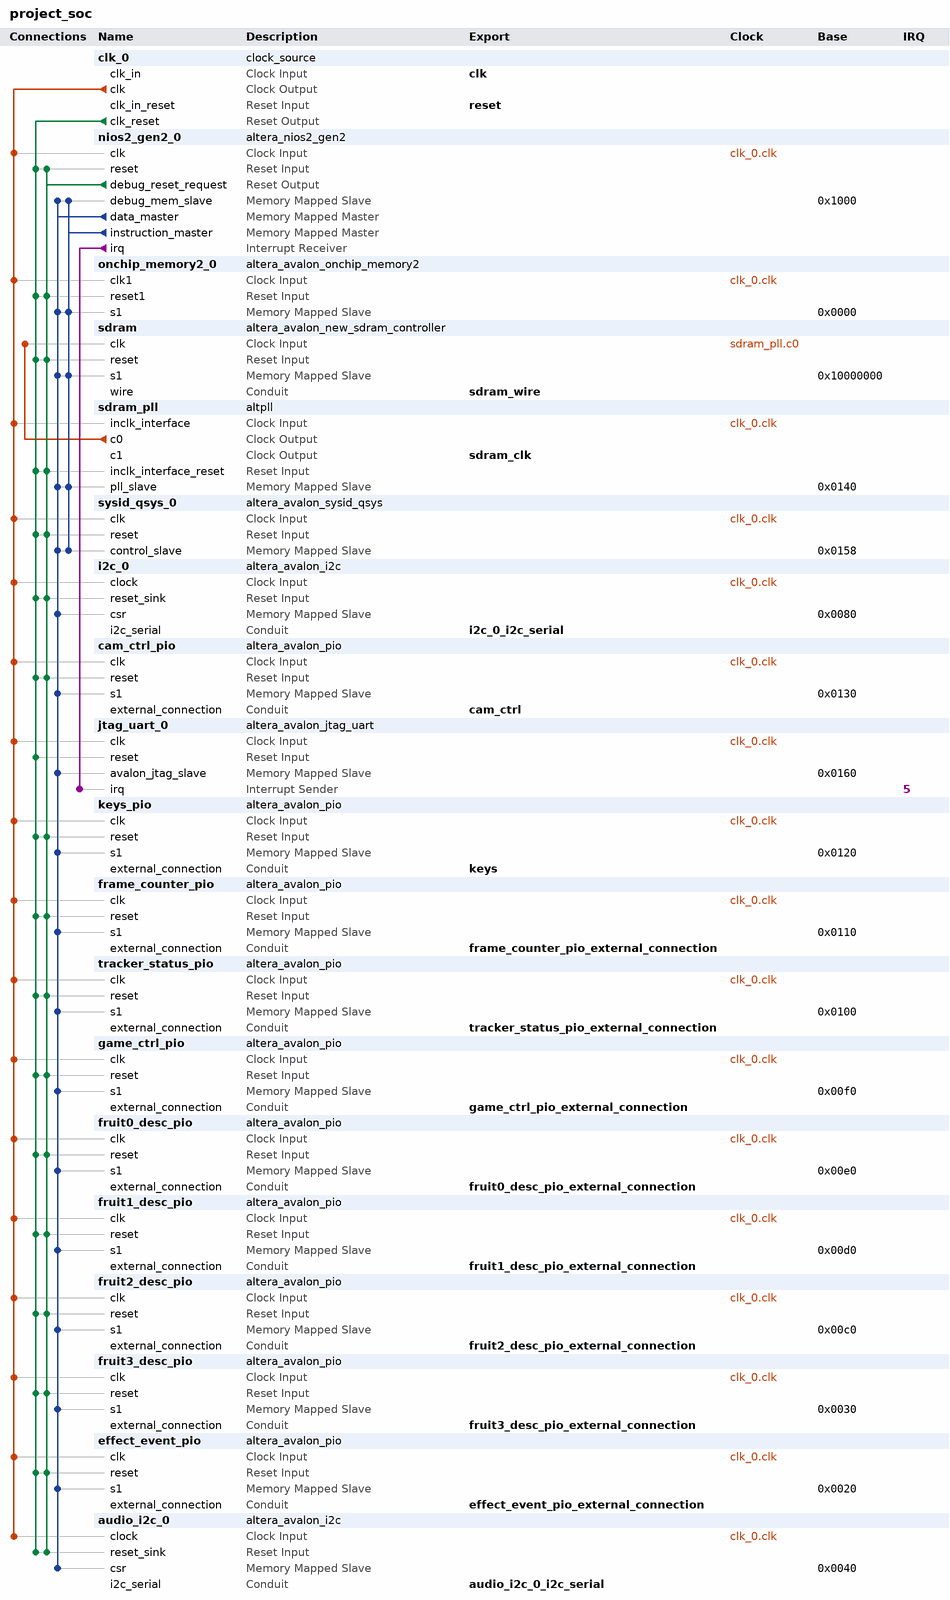
[diagram p0: system contents]
# Platform Designer (Qsys) system project_soc, Cyclone IV E EP4CE115F29C7
# Parameters at their usual value, and those the tool derives, are not listed.
package require -exact qsys 18.1
create_system project_soc
set_project_property DEVICE_FAMILY {Cyclone IV E}
set_project_property DEVICE EP4CE115F29C7

add_instance clk_0 clock_source 18.1
set_instance_parameter_value clk_0 clockFrequency 50000000

add_instance nios2_gen2_0 altera_nios2_gen2 18.1
set_instance_parameter_value nios2_gen2_0 dcache_size 2048
set_instance_parameter_value nios2_gen2_0 exceptionSlave sdram.s1
set_instance_parameter_value nios2_gen2_0 icache_size 4096
set_instance_parameter_value nios2_gen2_0 impl Tiny
set_instance_parameter_value nios2_gen2_0 resetSlave sdram.s1

add_instance onchip_memory2_0 altera_avalon_onchip_memory2 18.1
set_instance_parameter_value onchip_memory2_0 dataWidth 32
set_instance_parameter_value onchip_memory2_0 dualPort false
set_instance_parameter_value onchip_memory2_0 initMemContent true
set_instance_parameter_value onchip_memory2_0 initializationFileName onchip_mem.hex
set_instance_parameter_value onchip_memory2_0 memorySize 16

add_instance sdram altera_avalon_new_sdram_controller 18.1
set_instance_parameter_value sdram TAC 5.5
set_instance_parameter_value sdram TRCD 20.0
set_instance_parameter_value sdram TRP 20.0
set_instance_parameter_value sdram casLatency 3
set_instance_parameter_value sdram columnWidth 10
set_instance_parameter_value sdram dataWidth 32
set_instance_parameter_value sdram generateSimulationModel false
set_instance_parameter_value sdram model single_Micron_MT48LC4M32B2_7_chip
set_instance_parameter_value sdram numberOfBanks 4
set_instance_parameter_value sdram numberOfChipSelects 1
set_instance_parameter_value sdram powerUpDelay 200.0
set_instance_parameter_value sdram refreshPeriod 7.8125
set_instance_parameter_value sdram rowWidth 13

add_instance sdram_pll altpll 18.1
set_instance_parameter_value sdram_pll CLK0_DIVIDE_BY 1
set_instance_parameter_value sdram_pll CLK0_MULTIPLY_BY 1
set_instance_parameter_value sdram_pll CLK1_DIVIDE_BY 1
set_instance_parameter_value sdram_pll CLK1_DUTY_CYCLE 50
set_instance_parameter_value sdram_pll CLK1_MULTIPLY_BY 1
set_instance_parameter_value sdram_pll CLK1_PHASE_SHIFT -3000
set_instance_parameter_value sdram_pll INCLK0_INPUT_FREQUENCY 20000
set_instance_parameter_value sdram_pll PORT_ARESET PORT_UNUSED
set_instance_parameter_value sdram_pll PORT_LOCKED PORT_UNUSED
set_instance_parameter_value sdram_pll PORT_clk1 PORT_USED
set_instance_parameter_value sdram_pll PORT_clk2 PORT_UNUSED
set_instance_parameter_value sdram_pll PORT_clk3 PORT_UNUSED

add_instance sysid_qsys_0 altera_avalon_sysid_qsys 18.1
set_instance_parameter_value sysid_qsys_0 id 0

add_instance i2c_0 altera_avalon_i2c 18.1
set_instance_parameter_value i2c_0 FIFO_DEPTH 8

add_instance cam_ctrl_pio altera_avalon_pio 18.1
set_instance_parameter_value cam_ctrl_pio direction Output
set_instance_parameter_value cam_ctrl_pio resetValue 1
set_instance_parameter_value cam_ctrl_pio width 2

add_instance jtag_uart_0 altera_avalon_jtag_uart 18.1
set_instance_parameter_value jtag_uart_0 simInteractiveOptions NO_INTERACTIVE_WINDOWS

add_instance keys_pio altera_avalon_pio 18.1
set_instance_parameter_value keys_pio direction Input
set_instance_parameter_value keys_pio width 4

add_instance frame_counter_pio altera_avalon_pio 18.1
set_instance_parameter_value frame_counter_pio direction Input
set_instance_parameter_value frame_counter_pio width 32

add_instance tracker_status_pio altera_avalon_pio 18.1
set_instance_parameter_value tracker_status_pio direction Input
set_instance_parameter_value tracker_status_pio width 32

add_instance game_ctrl_pio altera_avalon_pio 18.1
set_instance_parameter_value game_ctrl_pio direction Output
set_instance_parameter_value game_ctrl_pio width 32

add_instance fruit0_desc_pio altera_avalon_pio 18.1
set_instance_parameter_value fruit0_desc_pio direction Output
set_instance_parameter_value fruit0_desc_pio width 32

add_instance fruit1_desc_pio altera_avalon_pio 18.1
set_instance_parameter_value fruit1_desc_pio direction Output
set_instance_parameter_value fruit1_desc_pio width 32

add_instance fruit2_desc_pio altera_avalon_pio 18.1
set_instance_parameter_value fruit2_desc_pio direction Output
set_instance_parameter_value fruit2_desc_pio width 32

add_instance fruit3_desc_pio altera_avalon_pio 18.1
set_instance_parameter_value fruit3_desc_pio direction Output
set_instance_parameter_value fruit3_desc_pio width 32

add_instance effect_event_pio altera_avalon_pio 18.1
set_instance_parameter_value effect_event_pio direction Output
set_instance_parameter_value effect_event_pio width 32

add_instance audio_i2c_0 altera_avalon_i2c 18.1
set_instance_parameter_value audio_i2c_0 FIFO_DEPTH 4

# connections
add_connection clk_0.clk audio_i2c_0.clock clock
add_connection clk_0.clk cam_ctrl_pio.clk clock
add_connection clk_0.clk effect_event_pio.clk clock
add_connection clk_0.clk frame_counter_pio.clk clock
add_connection clk_0.clk fruit0_desc_pio.clk clock
add_connection clk_0.clk fruit1_desc_pio.clk clock
add_connection clk_0.clk fruit2_desc_pio.clk clock
add_connection clk_0.clk fruit3_desc_pio.clk clock
add_connection clk_0.clk game_ctrl_pio.clk clock
add_connection clk_0.clk i2c_0.clock clock
add_connection clk_0.clk jtag_uart_0.clk clock
add_connection clk_0.clk keys_pio.clk clock
add_connection clk_0.clk nios2_gen2_0.clk clock
add_connection clk_0.clk onchip_memory2_0.clk1 clock
add_connection clk_0.clk sdram_pll.inclk_interface clock
add_connection clk_0.clk sysid_qsys_0.clk clock
add_connection clk_0.clk tracker_status_pio.clk clock
add_connection sdram_pll.c0 sdram.clk clock
add_connection clk_0.clk_reset audio_i2c_0.reset_sink reset
add_connection clk_0.clk_reset cam_ctrl_pio.reset reset
add_connection clk_0.clk_reset effect_event_pio.reset reset
add_connection clk_0.clk_reset frame_counter_pio.reset reset
add_connection clk_0.clk_reset fruit0_desc_pio.reset reset
add_connection clk_0.clk_reset fruit1_desc_pio.reset reset
add_connection clk_0.clk_reset fruit2_desc_pio.reset reset
add_connection clk_0.clk_reset fruit3_desc_pio.reset reset
add_connection clk_0.clk_reset game_ctrl_pio.reset reset
add_connection clk_0.clk_reset i2c_0.reset_sink reset
add_connection clk_0.clk_reset jtag_uart_0.reset reset
add_connection clk_0.clk_reset keys_pio.reset reset
add_connection clk_0.clk_reset nios2_gen2_0.reset reset
add_connection clk_0.clk_reset onchip_memory2_0.reset1 reset
add_connection clk_0.clk_reset sdram.reset reset
add_connection clk_0.clk_reset sdram_pll.inclk_interface_reset reset
add_connection clk_0.clk_reset sysid_qsys_0.reset reset
add_connection clk_0.clk_reset tracker_status_pio.reset reset
add_connection nios2_gen2_0.debug_reset_request audio_i2c_0.reset_sink reset
add_connection nios2_gen2_0.debug_reset_request cam_ctrl_pio.reset reset
add_connection nios2_gen2_0.debug_reset_request effect_event_pio.reset reset
add_connection nios2_gen2_0.debug_reset_request frame_counter_pio.reset reset
add_connection nios2_gen2_0.debug_reset_request fruit0_desc_pio.reset reset
add_connection nios2_gen2_0.debug_reset_request fruit1_desc_pio.reset reset
add_connection nios2_gen2_0.debug_reset_request fruit2_desc_pio.reset reset
add_connection nios2_gen2_0.debug_reset_request fruit3_desc_pio.reset reset
add_connection nios2_gen2_0.debug_reset_request game_ctrl_pio.reset reset
add_connection nios2_gen2_0.debug_reset_request i2c_0.reset_sink reset
add_connection nios2_gen2_0.debug_reset_request keys_pio.reset reset
add_connection nios2_gen2_0.debug_reset_request nios2_gen2_0.reset reset
add_connection nios2_gen2_0.debug_reset_request onchip_memory2_0.reset1 reset
add_connection nios2_gen2_0.debug_reset_request sdram.reset reset
add_connection nios2_gen2_0.debug_reset_request sdram_pll.inclk_interface_reset reset
add_connection nios2_gen2_0.debug_reset_request sysid_qsys_0.reset reset
add_connection nios2_gen2_0.debug_reset_request tracker_status_pio.reset reset
add_connection nios2_gen2_0.data_master audio_i2c_0.csr avalon
set_connection_parameter_value nios2_gen2_0.data_master/audio_i2c_0.csr baseAddress 0x0040
add_connection nios2_gen2_0.data_master cam_ctrl_pio.s1 avalon
set_connection_parameter_value nios2_gen2_0.data_master/cam_ctrl_pio.s1 baseAddress 0x0130
add_connection nios2_gen2_0.data_master effect_event_pio.s1 avalon
set_connection_parameter_value nios2_gen2_0.data_master/effect_event_pio.s1 baseAddress 0x0020
add_connection nios2_gen2_0.data_master frame_counter_pio.s1 avalon
set_connection_parameter_value nios2_gen2_0.data_master/frame_counter_pio.s1 baseAddress 0x0110
add_connection nios2_gen2_0.data_master fruit0_desc_pio.s1 avalon
set_connection_parameter_value nios2_gen2_0.data_master/fruit0_desc_pio.s1 baseAddress 0x00e0
add_connection nios2_gen2_0.data_master fruit1_desc_pio.s1 avalon
set_connection_parameter_value nios2_gen2_0.data_master/fruit1_desc_pio.s1 baseAddress 0x00d0
add_connection nios2_gen2_0.data_master fruit2_desc_pio.s1 avalon
set_connection_parameter_value nios2_gen2_0.data_master/fruit2_desc_pio.s1 baseAddress 0x00c0
add_connection nios2_gen2_0.data_master fruit3_desc_pio.s1 avalon
set_connection_parameter_value nios2_gen2_0.data_master/fruit3_desc_pio.s1 baseAddress 0x0030
add_connection nios2_gen2_0.data_master game_ctrl_pio.s1 avalon
set_connection_parameter_value nios2_gen2_0.data_master/game_ctrl_pio.s1 baseAddress 0x00f0
add_connection nios2_gen2_0.data_master i2c_0.csr avalon
set_connection_parameter_value nios2_gen2_0.data_master/i2c_0.csr baseAddress 0x0080
add_connection nios2_gen2_0.data_master jtag_uart_0.avalon_jtag_slave avalon
set_connection_parameter_value nios2_gen2_0.data_master/jtag_uart_0.avalon_jtag_slave baseAddress 0x0160
add_connection nios2_gen2_0.data_master keys_pio.s1 avalon
set_connection_parameter_value nios2_gen2_0.data_master/keys_pio.s1 baseAddress 0x0120
add_connection nios2_gen2_0.data_master nios2_gen2_0.debug_mem_slave avalon
set_connection_parameter_value nios2_gen2_0.data_master/nios2_gen2_0.debug_mem_slave baseAddress 0x1000
add_connection nios2_gen2_0.data_master onchip_memory2_0.s1 avalon
set_connection_parameter_value nios2_gen2_0.data_master/onchip_memory2_0.s1 baseAddress 0x0000
add_connection nios2_gen2_0.data_master sdram.s1 avalon
set_connection_parameter_value nios2_gen2_0.data_master/sdram.s1 baseAddress 0x10000000
add_connection nios2_gen2_0.data_master sdram_pll.pll_slave avalon
set_connection_parameter_value nios2_gen2_0.data_master/sdram_pll.pll_slave baseAddress 0x0140
add_connection nios2_gen2_0.data_master sysid_qsys_0.control_slave avalon
set_connection_parameter_value nios2_gen2_0.data_master/sysid_qsys_0.control_slave baseAddress 0x0158
add_connection nios2_gen2_0.data_master tracker_status_pio.s1 avalon
set_connection_parameter_value nios2_gen2_0.data_master/tracker_status_pio.s1 baseAddress 0x0100
add_connection nios2_gen2_0.instruction_master nios2_gen2_0.debug_mem_slave avalon
set_connection_parameter_value nios2_gen2_0.instruction_master/nios2_gen2_0.debug_mem_slave baseAddress 0x1000
add_connection nios2_gen2_0.instruction_master onchip_memory2_0.s1 avalon
set_connection_parameter_value nios2_gen2_0.instruction_master/onchip_memory2_0.s1 baseAddress 0x0000
add_connection nios2_gen2_0.instruction_master sdram.s1 avalon
set_connection_parameter_value nios2_gen2_0.instruction_master/sdram.s1 baseAddress 0x10000000
add_connection nios2_gen2_0.instruction_master sdram_pll.pll_slave avalon
set_connection_parameter_value nios2_gen2_0.instruction_master/sdram_pll.pll_slave baseAddress 0x0140
add_connection nios2_gen2_0.instruction_master sysid_qsys_0.control_slave avalon
set_connection_parameter_value nios2_gen2_0.instruction_master/sysid_qsys_0.control_slave baseAddress 0x0158
add_connection nios2_gen2_0.irq jtag_uart_0.irq interrupt
set_connection_parameter_value nios2_gen2_0.irq/jtag_uart_0.irq irqNumber 5

# exported interfaces
add_interface audio_i2c_0_i2c_serial conduit end
set_interface_property audio_i2c_0_i2c_serial EXPORT_OF audio_i2c_0.i2c_serial
add_interface cam_ctrl conduit end
set_interface_property cam_ctrl EXPORT_OF cam_ctrl_pio.external_connection
add_interface clk clock sink
set_interface_property clk EXPORT_OF clk_0.clk_in
add_interface effect_event_pio_external_connection conduit end
set_interface_property effect_event_pio_external_connection EXPORT_OF effect_event_pio.external_connection
add_interface frame_counter_pio_external_connection conduit end
set_interface_property frame_counter_pio_external_connection EXPORT_OF frame_counter_pio.external_connection
add_interface fruit0_desc_pio_external_connection conduit end
set_interface_property fruit0_desc_pio_external_connection EXPORT_OF fruit0_desc_pio.external_connection
add_interface fruit1_desc_pio_external_connection conduit end
set_interface_property fruit1_desc_pio_external_connection EXPORT_OF fruit1_desc_pio.external_connection
add_interface fruit2_desc_pio_external_connection conduit end
set_interface_property fruit2_desc_pio_external_connection EXPORT_OF fruit2_desc_pio.external_connection
add_interface fruit3_desc_pio_external_connection conduit end
set_interface_property fruit3_desc_pio_external_connection EXPORT_OF fruit3_desc_pio.external_connection
add_interface game_ctrl_pio_external_connection conduit end
set_interface_property game_ctrl_pio_external_connection EXPORT_OF game_ctrl_pio.external_connection
add_interface i2c_0_i2c_serial conduit end
set_interface_property i2c_0_i2c_serial EXPORT_OF i2c_0.i2c_serial
add_interface keys conduit end
set_interface_property keys EXPORT_OF keys_pio.external_connection
add_interface reset reset sink
set_interface_property reset EXPORT_OF clk_0.clk_in_reset
add_interface sdram_clk clock source
set_interface_property sdram_clk EXPORT_OF sdram_pll.c1
add_interface sdram_wire conduit end
set_interface_property sdram_wire EXPORT_OF sdram.wire
add_interface tracker_status_pio_external_connection conduit end
set_interface_property tracker_status_pio_external_connection EXPORT_OF tracker_status_pio.external_connection

set_interconnect_requirement {$system} qsys_mm.clockCrossingAdapter HANDSHAKE
set_interconnect_requirement {$system} qsys_mm.enableEccProtection FALSE
set_interconnect_requirement {$system} qsys_mm.insertDefaultSlave FALSE
set_interconnect_requirement {$system} qsys_mm.maxAdditionalLatency 1

save_system project_soc.qsys
